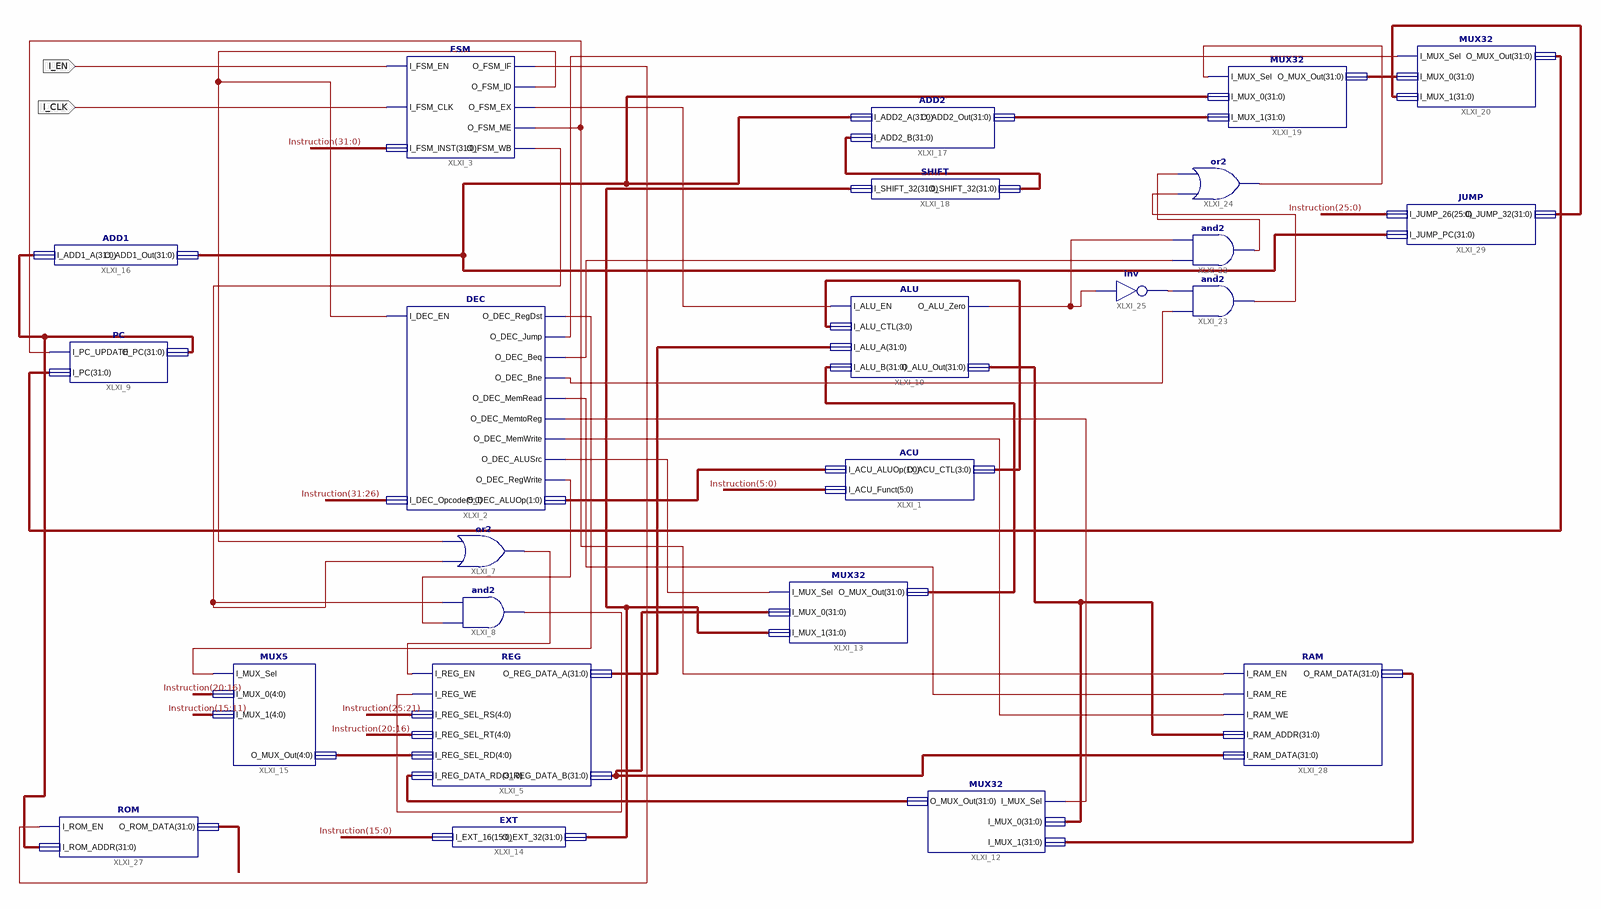
[diagram p0: schematic sheet 1]
// Xilinx ISE schematic CCSiMP32.sch (artix7) as structural Verilog: 24 symbols, 2 ports
module CCSiMP32 (
  input  I_EN,
  input  I_CLK
);

  wire XLXN_15, XLXN_24, XLXN_76, XLXN_94, XLXN_111, XLXN_132, XLXN_145, XLXN_155, XLXN_159, XLXN_161,
       XLXN_162, XLXN_163, XLXN_164, XLXN_165, XLXN_166, XLXN_201, XLXN_204, XLXN_211, XLXN_215, XLXN_216,
       XLXN_222;
  wire [1:0] XLXN_62;
  wire [3:0] XLXN_116;
  wire [4:0] XLXN_144;
  wire [31:0] Instruction, XLXN_90, XLXN_117, XLXN_128, XLXN_136, XLXN_138, XLXN_140, XLXN_149, XLXN_150,
       XLXN_153, XLXN_154, XLXN_158, XLXN_224, XLXN_226, XLXN_229;

  ACU XLXI_1 (.I_ACU_ALUOp(XLXN_62), .I_ACU_Funct(Instruction[5:0]), .O_ACU_CTL(XLXN_116));
  DEC XLXI_2 (
    .I_DEC_EN(XLXN_15), .I_DEC_Opcode(Instruction[31:26]), .O_DEC_RegDst(XLXN_145), .O_DEC_Jump(XLXN_155),
    .O_DEC_Beq(XLXN_162), .O_DEC_Bne(XLXN_163), .O_DEC_MemRead(XLXN_204), .O_DEC_MemtoReg(XLXN_201),
    .O_DEC_MemWrite(XLXN_94), .O_DEC_ALUSrc(XLXN_132), .O_DEC_RegWrite(XLXN_24), .O_DEC_ALUOp(XLXN_62));
  FSM XLXI_3 (
    .I_FSM_EN(I_EN), .I_FSM_CLK(I_CLK), .I_FSM_INST(Instruction), .O_FSM_IF(XLXN_222), .O_FSM_ID(XLXN_15),
    .O_FSM_EX(XLXN_216), .O_FSM_ME(XLXN_211), .O_FSM_WB(XLXN_215));
  REG XLXI_5 (
    .I_REG_EN(XLXN_111), .I_REG_WE(XLXN_76), .I_REG_SEL_RS(Instruction[25:21]),
    .I_REG_SEL_RT(Instruction[20:16]), .I_REG_SEL_RD(XLXN_144), .I_REG_DATA_RD(XLXN_117),
    .O_REG_DATA_A(XLXN_138), .O_REG_DATA_B(XLXN_224));
  or XLXI_7 (XLXN_111, XLXN_215, XLXN_15);
  and XLXI_8 (XLXN_76, XLXN_24, XLXN_215);
  PC XLXI_9 (.I_PC_UPDATE(XLXN_211), .I_PC(XLXN_154), .O_PC(XLXN_90));
  ALU XLXI_10 (
    .I_ALU_EN(XLXN_216), .I_ALU_CTL(XLXN_116), .I_ALU_A(XLXN_138), .I_ALU_B(XLXN_140), .O_ALU_Zero(XLXN_159),
    .O_ALU_Out(XLXN_128));
  MUX32 XLXI_12 (.I_MUX_Sel(XLXN_201), .I_MUX_0(XLXN_128), .I_MUX_1(XLXN_226), .O_MUX_Out(XLXN_117));
  MUX32 XLXI_13 (.I_MUX_Sel(XLXN_132), .I_MUX_0(XLXN_224), .I_MUX_1(XLXN_136), .O_MUX_Out(XLXN_140));
  EXT XLXI_14 (.I_EXT_16(Instruction[15:0]), .O_EXT_32(XLXN_136));
  MUX5 XLXI_15 (.I_MUX_Sel(XLXN_145), .I_MUX_0(Instruction[20:16]), .I_MUX_1(Instruction[15:11]), .O_MUX_Out(XLXN_144));
  ADD1 XLXI_16 (.I_ADD1_A(XLXN_90), .O_ADD1_Out(XLXN_150));
  ADD2 XLXI_17 (.I_ADD2_A(XLXN_150), .I_ADD2_B(XLXN_149), .O_ADD2_Out(XLXN_158));
  SHIFT XLXI_18 (.I_SHIFT_32(XLXN_136), .O_SHIFT_32(XLXN_149));
  MUX32 XLXI_19 (.I_MUX_Sel(XLXN_166), .I_MUX_0(XLXN_150), .I_MUX_1(XLXN_158), .O_MUX_Out(XLXN_153));
  MUX32 XLXI_20 (.I_MUX_Sel(XLXN_155), .I_MUX_0(XLXN_153), .I_MUX_1(XLXN_229), .O_MUX_Out(XLXN_154));
  and XLXI_22 (XLXN_164, XLXN_162, XLXN_159);
  and XLXI_23 (XLXN_165, XLXN_163, XLXN_161);
  or XLXI_24 (XLXN_166, XLXN_165, XLXN_164);
  not XLXI_25 (XLXN_161, XLXN_159);
  ROM XLXI_27 (.I_ROM_EN(XLXN_222), .I_ROM_ADDR(XLXN_90), .O_ROM_DATA(Instruction));
  RAM XLXI_28 (
    .I_RAM_EN(XLXN_211), .I_RAM_RE(XLXN_204), .I_RAM_WE(XLXN_94), .I_RAM_ADDR(XLXN_128),
    .I_RAM_DATA(XLXN_224), .O_RAM_DATA(XLXN_226));
  JUMP XLXI_29 (.I_JUMP_26(Instruction[25:0]), .I_JUMP_PC(XLXN_150), .O_JUMP_32(XLXN_229));
endmodule
